# Altium schematic sheet TDS_EZO_1.SchDoc
size A4
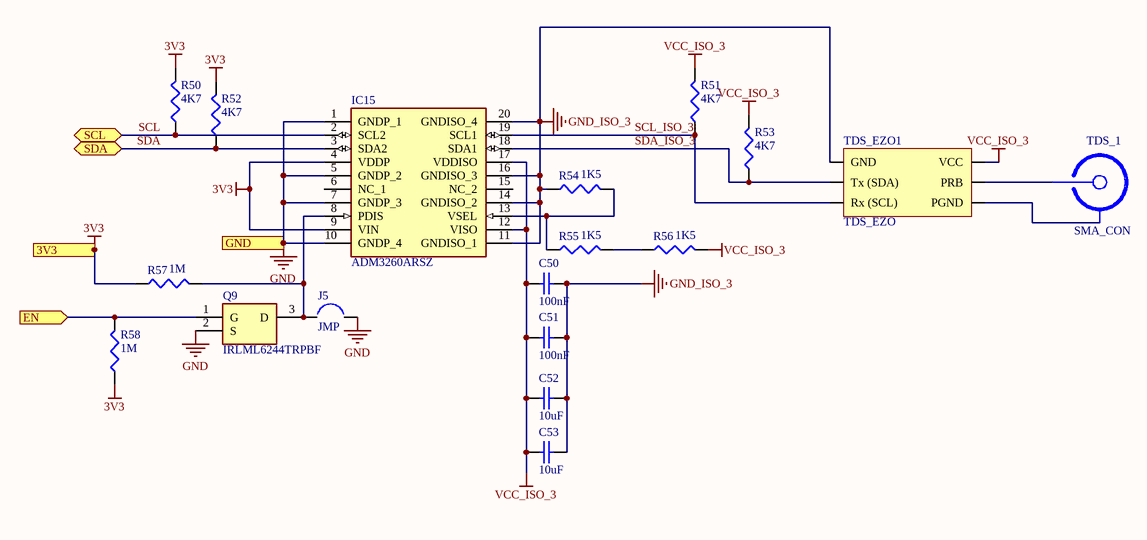
[diagram p0: TDS_EZO_1.SchDoc]

## Parts
C50  100nF  [1608[0603]]
C51  100nF  [1608[0603]]
C52  10uF  [1608[0603]]
C53  10uF  [1608[0603]]
IC15  ADM3260ARSZ  [SOP65P780X200-20N]
J5  JMP  [Jumper]
Q9  IRLML6244TRPBF  [SOT95P237X112-3N]
R50  4K7  [J1-0603]
R51  4K7  [J1-0603]
R52  4K7  [J1-0603]
R53  4K7  [J1-0603]
R54  1K5  [J1-0603]
R55  1K5  [J1-0603]
R56  1K5  [J1-0603]
R57  1M  [J1-0603]
R58  1M  [J1-0603]
TDS_1  SMA_CON  [PCBSMAFRAHT]
TDS_EZO1  TDS_EZO  [TDS_EZO]

## Ports
3V3, EN (in), GND, SCL (bidir), SDA (bidir)

## Nets
3V3: IC15.4(VDDP) IC15.9(VIN) R50.2 R52.2 R57.1 R58.1 ; port 3V3
GND: IC15.1(GNDP_1) IC15.5(GNDP_2) IC15.7(GNDP_3) IC15.10(GNDP_4) J5.2 Q9.2(S) ; port GND
GND_ISO_3: C50.2 C51.2 C52.2 C53.2 IC15.11(GNDISO_1) IC15.14(GNDISO_2) IC15.16(GNDISO_3) IC15.20(GNDISO_4) R54.1 TDS_EZO1.1(GND)
VCC_ISO_3: C50.1 C51.1 C52.1 C53.1 IC15.12(VISO) IC15.17(VDDISO) R51.2 R53.2 R56.2 TDS_EZO1.4(VCC)
EN: Q9.1(G) R58.2 ; port EN
SCL: IC15.2(SCL2) R50.1 ; port SCL
SCL_ISO_3: IC15.19(SCL1) R51.1 TDS_EZO1.3(Rx_(SCL))
SDA: IC15.3(SDA2) R52.1 ; port SDA
SDA_ISO_3: IC15.18(SDA1) R53.1 TDS_EZO1.2(Tx_(SDA))
NetIC15_8: IC15.8(PDIS) J5.1 Q9.3(D) R57.2
NetIC15_13: IC15.13(VSEL) R54.2 R55.1
NetR55_2: R55.2 R56.1
NetTDS_1_1: TDS_1.1 TDS_EZO1.5(PRB)
NetTDS_1_2: TDS_1.2 TDS_EZO1.6(PGND)

Not connected (* = marked no-connect by the designer): IC15 6(NC_1) 15(NC_2)

## Library data of the parts
C50 C51 = Cap Semi: Capacitor (Semiconductor SIM Model); Published: 8-Jun-2000; LatestRevisionDate: 29-May-2009; LatestRevisionNote: IPC-7351 Footprint Added.; PackageReference: C1206; Publisher: Altium Limited; PackageDescription: Chip Capacitor; Value: 100nF
C52 C53 = Cap Semi: Capacitor (Semiconductor SIM Model); Value: 100nF; Published: 8-Jun-2000; LatestRevisionDate: 29-May-2009; LatestRevisionNote: IPC-7351 Footprint Added.; PackageReference: C1206; Publisher: Altium Limited; PackageDescription: Chip Capacitor
IC15 = ADM3260ARSZ: Integrated Circuit; Manufacturer_Name: Analog Devices; Datasheet Link: http://www.farnell.com/datasheets/2037088.pdf; Height: 2mm; Manufacturer_Part_Number: ADM3260ARSZ; Mouser Part Number: 584-ADM3260ARSZ; Mouser Price/Stock: https://www.mouser.com/Search/Refine.aspx?Keyword=584-ADM3260ARSZ; RS Part Number: 8319113P; RS Price/Stock: http://uk.rs-online.com/web/p/products/8319113P
Q9 = IRLML6244TRPBF: Transistor; Manufacturer_Name: Infineon; Allied_Number: 70411468; Datasheet Link: http://www.infineon.com/dgdl/irlml6244pbf.pdf?fileId=5546d462533600a4015356686fed261f; Height: 1.12mm; Manufacturer_Part_Number: IRLML6244TRPBF; Mouser Part Number: 942-IRLML6244TRPBF; Mouser Price/Stock: https://www.mouser.com/Search/Refine.aspx?Keyword=942-IRLML6244TRPBF; RS Part Number: 7377228P; RS Price/Stock: http://at.rs-online.com/web/p/products/7377228P; Allied Price/Stock: https://www.alliedelec.com/infineon-irlml6244trpbf/70411468/
R50-R58 = Res3: Resistor; Published: 8-Jun-2000; LatestRevisionDate: 29-May-2009; LatestRevisionNote: IPC-7351 Footprint Added.; PackageReference: J1-0603; Publisher: Altium Limited; PackageDescription: Chip Resistor
  R50-R53: Value: 4K7
  R54-R56: Value: 1K5
  R57 R58: Value: 1M
TDS_1 = SMA: Connector; Manufacturer_Name: Taoglas; Manufacturer_Part_Number: PCB.SMAFRA.HT; Datasheet Link: https://www.mouser.com/datasheet/2/398/PCB.SMAFRA.HT_-1220750.pdf; Height: 9mm; Mouser Part Number: 960-PCB.SMAFRA.HT; Mouser Price/Stock: https://www.mouser.co.uk/ProductDetail/Taoglas/PCBSMAFRAHT?qs=RuW%2Fu%252BNMQmubIFYcN8w5Dw%3D%3D